# Altium schematic sheet ShutdownLoop.SchDoc: QUTMS Shutdown V2 - ShutdownLoop
size A3; Organization: QUT Motorsport; Address1: O-120; Address2: O Block; Address3: QUT Gardnes Point; Address4: Brisbane, 4000; DocumentNumber: 2; SheetNumber: 2; SheetTotal: 13
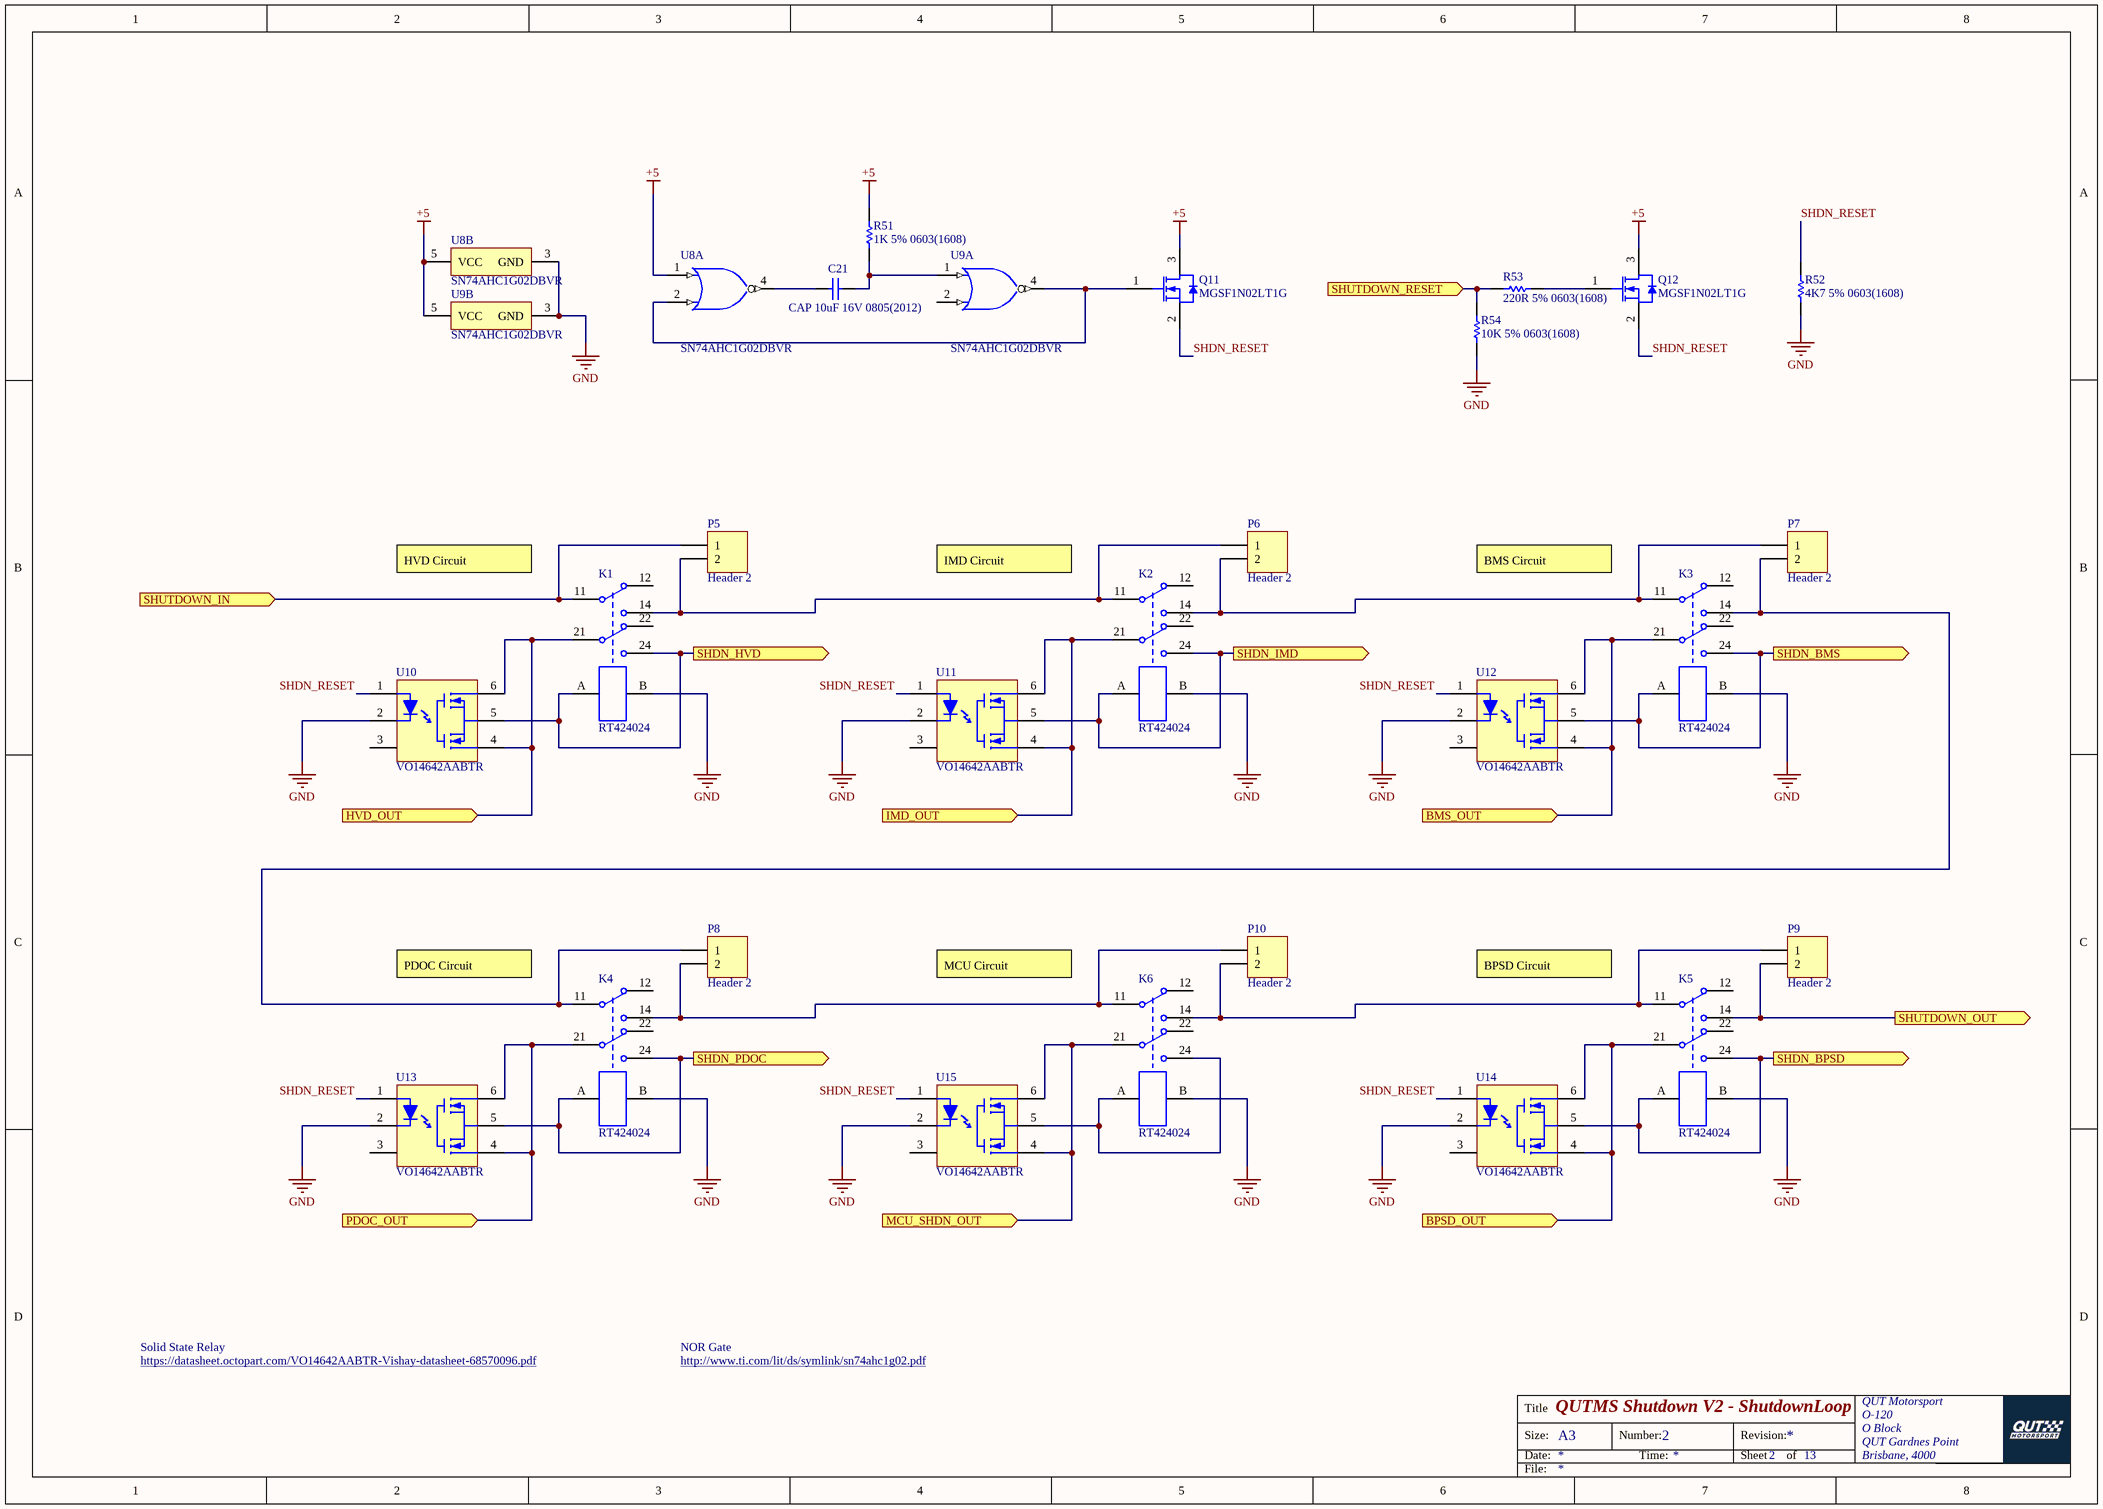
[diagram p0: ShutdownLoop.SchDoc]

## Parts
C21  CAP 10uF 16V 0805(2012)  [CAPC0805(2012)100_L]
K1  RT424024  [TECO-RT424024_V]
K2  RT424024  [TECO-RT424024_V]
K3  RT424024  [TECO-RT424024_V]
K4  RT424024  [TECO-RT424024_V]
K5  RT424024  [TECO-RT424024_V]
K6  RT424024  [TECO-RT424024_V]
P5  Header 2  [HDR1X2]
P6  Header 2  [HDR1X2]
P7  Header 2  [HDR1X2]
P8  Header 2  [HDR1X2]
P9  Header 2  [HDR1X2]
P10  Header 2  [HDR1X2]
Q11  MGSF1N02LT1G  [ONSC-SOT-23-3-318-08_V]
Q12  MGSF1N02LT1G  [ONSC-SOT-23-3-318-08_V]
R51  1K 5% 0603(1608)  [RESC0603(1608)_L]
R52  4K7 5% 0603(1608)  [RESC0603(1608)_N]
R53  220R 5% 0603(1608)  [RESC0603(1608)_M]
R54  10K 5% 0603(1608)  [RESC0603(1608)_N]
U8  SN74AHC1G02DBVR  [DBV0005A_L]  (parts A,B of 2)
U9  SN74AHC1G02DBVR  [DBV0005A_L]  (parts A,B of 2)
U10  VO14642AABTR  [VISH-VO14642AABTR_V]
U11  VO14642AABTR  [VISH-VO14642AABTR_V]
U12  VO14642AABTR  [VISH-VO14642AABTR_V]
U13  VO14642AABTR  [VISH-VO14642AABTR_V]
U14  VO14642AABTR  [VISH-VO14642AABTR_V]
U15  VO14642AABTR  [VISH-VO14642AABTR_V]

## Ports
BMS_OUT (in), BPSD_OUT (in), HVD_OUT (in), IMD_OUT (in), MCU_SHDN_OUT (in), PDOC_OUT (in), SHDN_BMS (out), SHDN_BPSD (out), SHDN_HVD (out), SHDN_IMD (out), SHDN_PDOC (out), SHUTDOWN_IN (in), SHUTDOWN_OUT (out), SHUTDOWN_RESET (in)

## Nets
+5: Q11.3(D) Q12.3(D) R51.2 U8.1(A) U8.5(VCC) U9.5(VCC)
GND: K1.B K2.B K3.B K4.B K5.B K6.B R52.1 R54.1 U8.3(GND) U9.3(GND) U10.2(K) U11.2(K) U12.2(K) U13.2(K) U14.2(K) U15.2(K)
BMS_OUT: K3.21 U12.4(S') U12.6(S) ; port BMS_OUT
BPSD_OUT: K5.21 U14.4(S') U14.6(S) ; port BPSD_OUT
HVD_OUT: K1.21 U10.4(S') U10.6(S) ; port HVD_OUT
IMD_OUT: K2.21 U11.4(S') U11.6(S) ; port IMD_OUT
MCU_SHDN_OUT: K6.21 U15.4(S') U15.6(S) ; port MCU_SHDN_OUT
PDOC_OUT: K4.21 U13.4(S') U13.6(S) ; port PDOC_OUT
SHDN_BMS: K3.24 K3.A U12.5(DC) ; port SHDN_BMS
SHDN_BPSD: K5.24 K5.A U14.5(DC) ; port SHDN_BPSD
SHDN_HVD: K1.24 K1.A U10.5(DC) ; port SHDN_HVD
SHDN_IMD: K2.24 K2.A U11.5(DC) ; port SHDN_IMD
SHDN_PDOC: K4.24 K4.A U13.5(DC) ; port SHDN_PDOC
SHDN_RESET: Q11.2(S) Q12.2(S) R52.2 U10.1(A) U11.1(A) U12.1(A) U13.1(A) U14.1(A) U15.1(A)
SHUTDOWN_IN: K1.11 P5.1 ; port SHUTDOWN_IN
SHUTDOWN_OUT: K5.14 P9.2 ; port SHUTDOWN_OUT
SHUTDOWN_RESET: R53.1 R54.2 ; port SHUTDOWN_RESET
NetC21_1: C21.1 U8.4(Y)
NetC21_2: C21.2 R51.1 U9.1(A)
NetK1_14: K1.14 K2.11 P5.2 P6.1
NetK2_14: K2.14 K3.11 P6.2 P7.1
NetK3_14: K3.14 K4.11 P7.2 P8.1
NetK4_14: K4.14 K6.11 P8.2 P10.1
NetK5_11: K5.11 K6.14 P9.1 P10.2
NetK6_24: K6.24 K6.A U15.5(DC)
NetQ11_1: Q11.1(G) U8.2(B) U9.4(Y)
NetQ12_1: Q12.1(G) R53.2

Not connected (* = marked no-connect by the designer): K1 12 22; K2 12 22; K3 12 22; K4 12 22; K5 12 22; K6 12 22; U9 2(B); U10 3(NC); U11 3(NC); U12 3(NC); U13 3(NC); U14 3(NC); U15 3(NC)

## Notes on the sheet
- HVD Circuit
- IMD Circuit
- BMS Circuit
- PDOC Circuit
- MCU Circuit
- BPSD Circuit
- https://datasheet.octopart.com/VO14642AABTR-Vishay-datasheet-68570096.pdf
- Solid State Relay
- http://www.ti.com/lit/ds/symlink/sn74ahc1g02.pdf
- NOR Gate
- Title
- Size:
- Date:
- A3
- Number:
- Time:
- Revision:
- Sheet
- of
- File:

## Library data of the parts
C21 = CMP-1036-04928-1: CAP 10uF 16V ±10% 0805 (2012 Metric) Thickness 1mm SMD; Tolerance: Â±10%; Case-Metric: 2012; Case-EIA: 0805; Rated Voltage: 16 V; Technology: SMT; Max Thickness: 1 mm; Value: 10uF
K1-K6 = CMP-2000-06999-1: DPDT 2 Form C (CO) Low Power PCB Relay, 24 VDC, 8 A, -40 to 85 degC, 8-Pin THD, RoHS, Tube; Manufacturer: TE Connectivity; Contact Form: 2FormC(DPDT-BM); Coil Current: 16.7mA; Coil Voltage: 24V; Coil Resistance: 1440Ohms; Contact Current Rating: 8A; Datasheet URL: http://www.te.com/commerce/DocumentDelivery/DDEController?Action=showdoc&DocId=Data+Sheet%7FRT2%7F1014%7Fpdf%7FEnglish%7FENG_DS_RT2_1014.pdf%7F6-1393243-8; Contact Material: SilverNickel; Datasheet Version: 10/2014; Package Description: 8-Pin Through Hole Device, Body 29 x 12.7 mm, Height 15.7 mm; Package Reference: RT424024; Mounting Style: ThroughHole; Mounting Technology: ThroughHole; Manufacturer URL: http://www.te.com/
P5-P10 = Header 2: Header, 2-Pin; LatestRevisionDate: 17-Jul-2002; LatestRevisionNote: Re-released for DXP Platform.; Publisher: Altium Limited
Q11 Q12 = CMP-1058-00777-1: Power MOSFET, 750 mA, 20 V, N-Channel, 3-Pin SOT-23, Pb-Free, Tape and Reel; Manufacturer: On Semiconductor; Crss Typ (pF): 45; Ciss Typ (pF): 125; VGS(th) Max (V): 2.4; Coss Typ (pF): 120; PD Max (W): 0.4; VGS Max (V): 20; Configuration: Single; Channel Polarity: N Channel; ID Max (A): 0.75; PackageReference: SOT-23-3-318-08; ComponentLink2Description: Datasheet; PackageVersion: Rev. AP, 11/2009; ComponentLink1URL: http://www.onsemi.com/; RoHS: Pb-Free; Mounting Technology: Surface Mount; Package Type: SOT-23-3; ComponentLink1Description: Manufacturer URL; V(BR)DSS Min (V): 20; PackageDescription: 3-Pin Small Outline Transistor, Body 2.92 x 1.3 mm, Pitch 0.95 mm; Packing: Tape and Reel; PartNumber: MGSF1N02LT1G; DatasheetVersion: Rev. 6; ComponentLink2URL: http://www.onsemi.cn/pub_link/Collateral/MGSF1N02LT1-D.PDF; ComponentLink3URL: http://www.onsemi.cn/pub_link/Collateral/318-08.PDF; ComponentLink3Description: Package Specification
R51 = CMP-1012-00074-1: 1K 0.1W 5% 0603 (1608 Metric)  SMD; Case-EIA: 0603; Case-Metric: 1608; Value: 1000.00 Ohm; Technology: SMT; Tolerance: 5 %; Power: 0.1 W
R52 = CMP-1012-00090-1: 4K7 0.1W 5% 0603 (1608 Metric)  SMD; Case-Metric: 1608; Value: 4700.00 Ohm; Case-EIA: 0603; Tolerance: 5 %; Technology: SMT; Power: 0.1 W
R53 = CMP-1012-00058-1: 220R 0.1W 5% 0603 (1608 Metric)  SMD; Case-EIA: 0603; Case-Metric: 1608; Value: 220.00 Ohm; Technology: SMT; Power: 0.1 W; Tolerance: 5 %
R54 = CMP-1012-00098-1: 10K 0.1W 5% 0603 (1608 Metric)  SMD; Case-EIA: 0603; Value: 10000.00 Ohm; Case-Metric: 1608; Technology: SMT; Tolerance: 5 %; Power: 0.1 W
U8 U9 = CMP-0859-00024-3: Single 2-Input Positive-NOR Gate, DBV0005A, LARGE T&R; Manufacturer: Texas Instruments; Output Drive (IOL/IOH)(Max)(mA): 50/-50; Sub-Family: NAND Gate; Gate Type: NOR; Output Type: CMOS; 3-State Output: No; Voltage(Nom)(V): 3.3,5; tpd @ Nom Voltage(Max)(ns): 11.4,7.5; Bits(#): 1; VCC(Max)(V): 5.5; ICC @ Nom Voltage(Max)(mA): 0.01; VCC(Min)(V): 2; Technology Family: AHC; Rating: Catalog; Logic: True; F @ Nom Voltage(Max)(Mhz): 75; DatasheetVersion: SCLS342M; Input Type: CMOS; Operating Temperature Range(C): -40 to 125,-40 to 85; Generic Part Number: SN74AHC1G02; PackageReference: DBV0005A; Schmitt Trigger: No
U10-U15 = CMP-2000-07398-1: 1 Form A Solid State Relay, 2 A, -40 to 85 degC, 6-Pin SMD, RoHS, Tape and Reel; Manufacturer: Vishay; Voltage - Input: 1.3VDC; Load Current: 2A; On-State Resistance: 250mOhm; Dynamic Catalog: VO14; Circuit: SPST-NO(1FormA); Output Type: AC,DC; Voltage - Load: 0~60V; Termination Style: GullWing; Standard Package: 1,000; Quantity Available: Tape&Reel(TR); Supplier Device Package: 6-SMD; Package Description: 6-Pin Surface Mount Device, Body 8.6 x 6.4 mm, Pitch 2.54 mm; Datasheet URL: https://datasheet.ciiva.com/26817/getdatasheetpartid-484357-26817425.pdf; Package / Case: 6-SMD(0.300",7.62mm); Manufacturer URL: http://www.vishay.com/; Relay Type: Relay; Category: Relays; Package Reference: VO14642AABTR; Minimum Quantity: SPST-NO(1FormA); Online Catalog: VO14; Datasheet Version: Rev. 1.5, 04/2011; Family: SolidStateRelays; Mounting Type: SurfaceMount; Packaging: Tape&Reel(TR); Mounting Technology: SurfaceMount